# Altium schematic sheet 0135_EC_STRAP.SchDoc
size A3
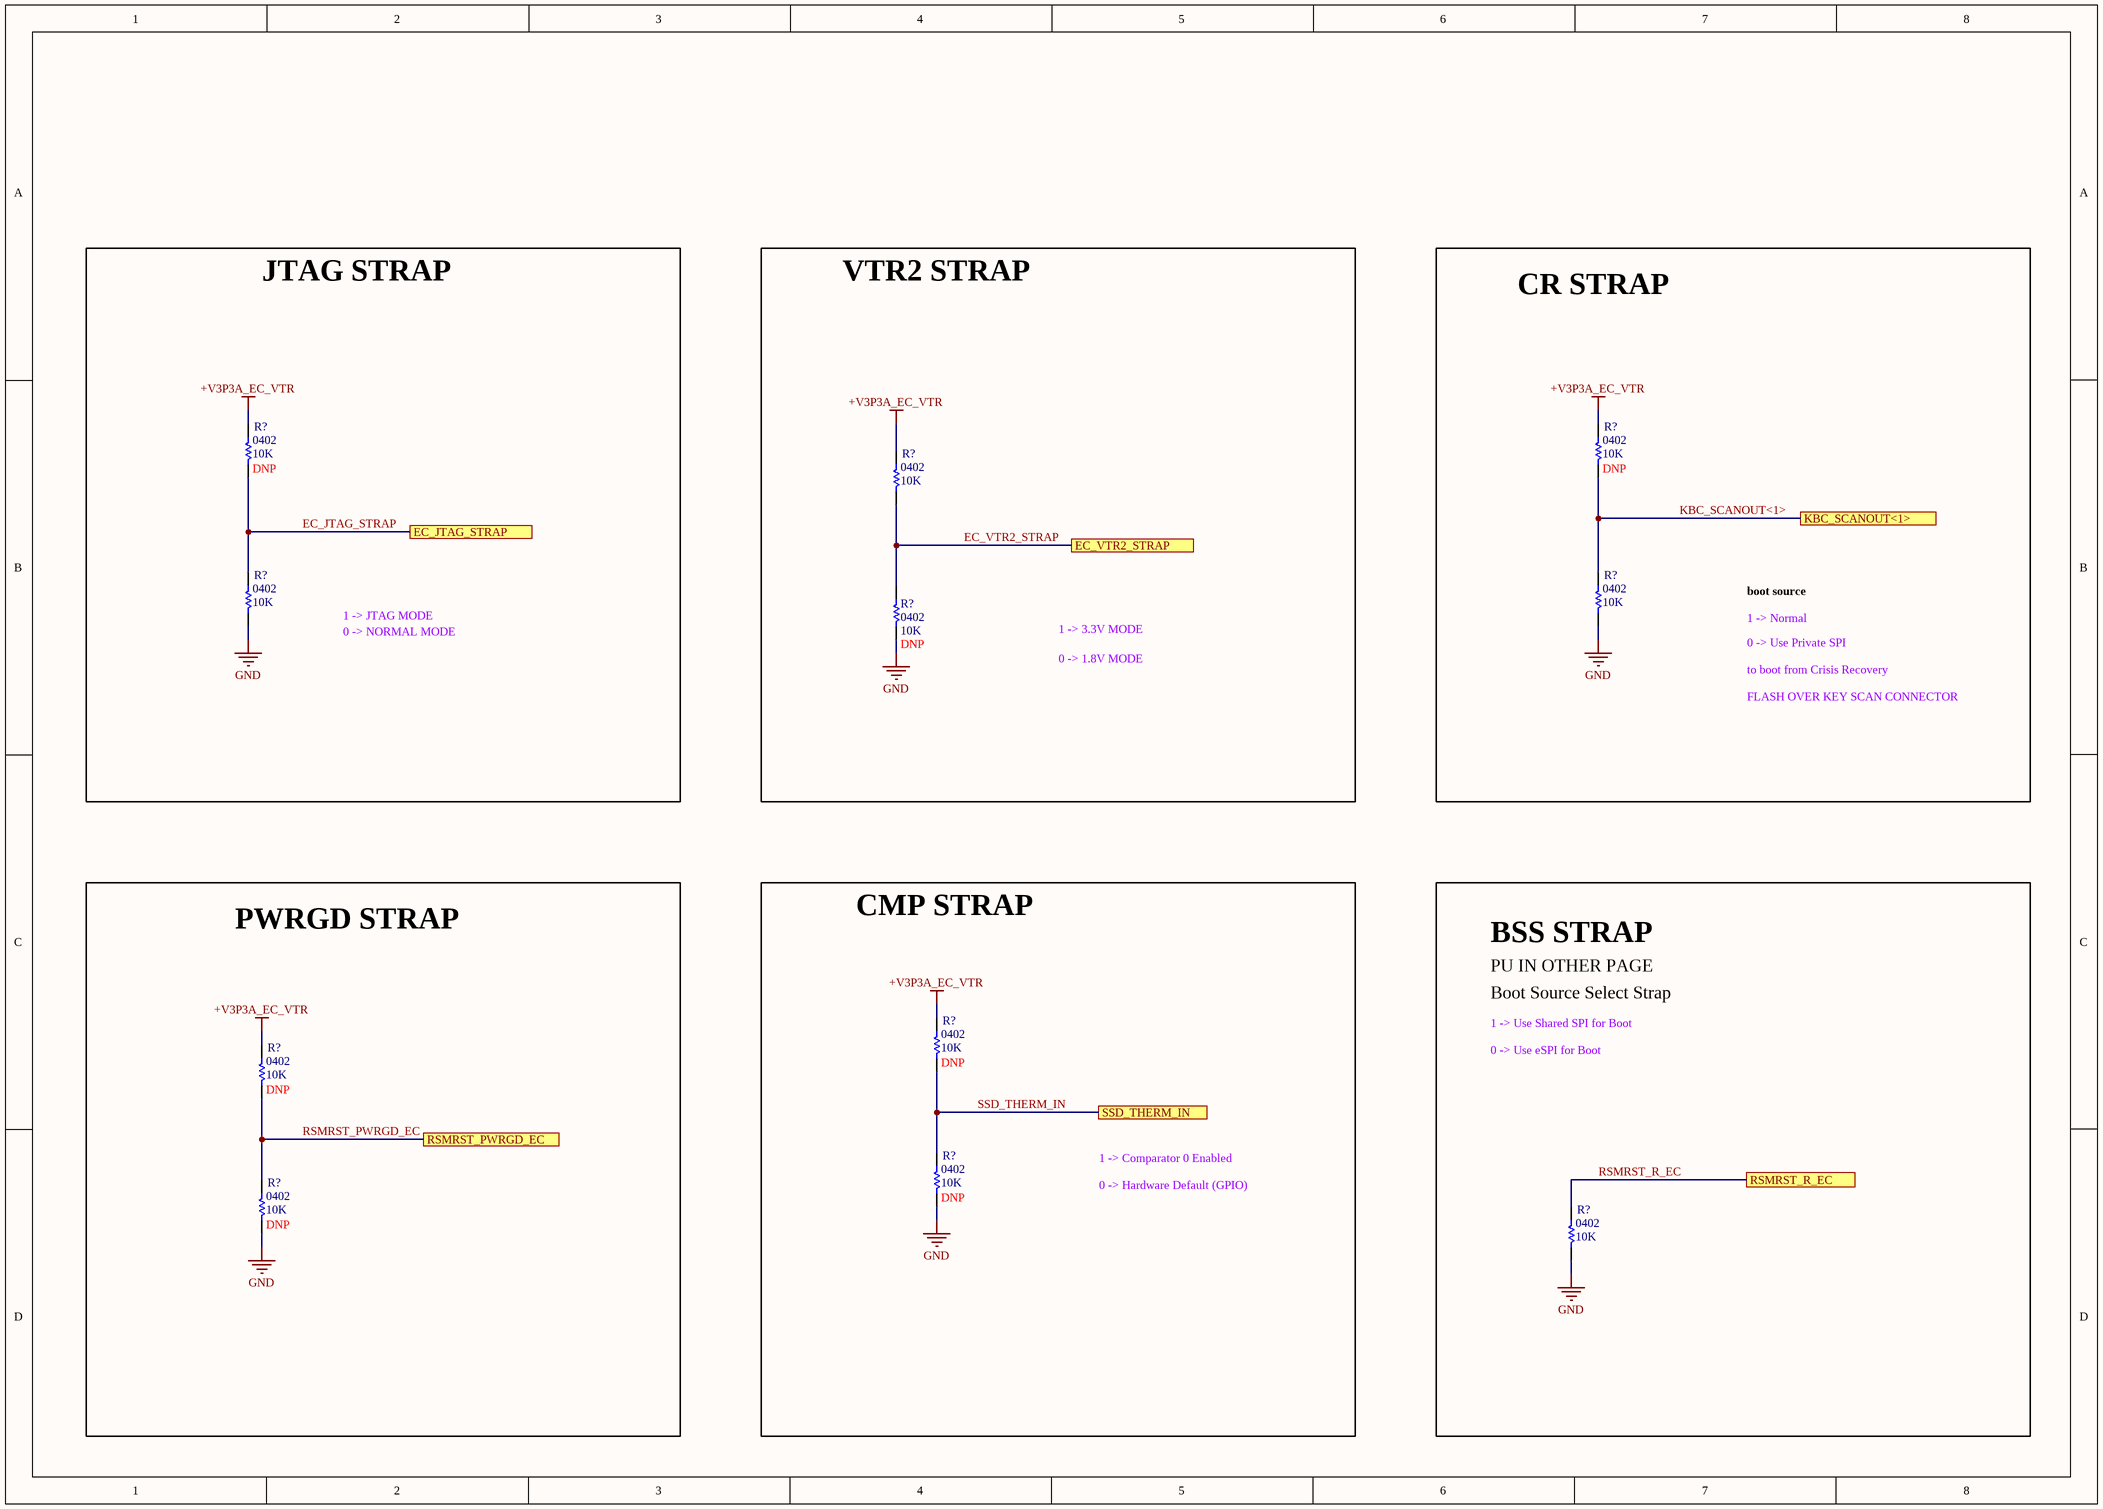
[diagram p0: 0135_EC_STRAP.SchDoc]

## Parts
(Parts that share a designator on the sheet are numbered #1, #2 ... from top to bottom, then left to right.)
R?#1  value 10K  Case/Package: 0402  [RESC0402]  (hidden comment: Res)
R?#2  value 10K  Case/Package: 0402  [RESC0402]  (hidden comment: Res)
R?#3  value 10K  Case/Package: 0402  [RESC0402]  (hidden comment: Res)
R?#4  value 10K  Case/Package: 0402  [RESC0402]  (hidden comment: Res)
R?#5  value 10K  Case/Package: 0402  [RESC0402]  (hidden comment: Res)
R?#6  value 10K  Case/Package: 0402  [RESC0402]  (hidden comment: Res)
R?#7  value 10K  Case/Package: 0402  [RESC0402]  (hidden comment: Res)
R?#8  value 10K  Case/Package: 0402  [RESC0402]  (hidden comment: Res)
R?#9  value 10K  Case/Package: 0402  [RESC0402]  (hidden comment: Res)
R?#10  value 10K  Case/Package: 0402  [RESC0402]  (hidden comment: Res)
R?#11  value 10K  Case/Package: 0402  [RESC0402]  (hidden comment: Res)

## Blocks framed on the sheet
JTAG STRAP: R?#1 R?#4
VTR2 STRAP: R?#3 R?#6
CR STRAP: R?#2 R?#5
PWRGD STRAP: R?#8 R?#10
CMP STRAP: R?#7 R?#9
BSS STRAP: R?#11

## Ports
EC_JTAG_STRAP, EC_VTR2_STRAP, KBC_SCANOUT<1>, RSMRST_PWRGD_EC, RSMRST_R_EC, SSD_THERM_IN

## Nets
+V3P3A_EC_VTR: R?#1.2 R?#2.2 R?#3.2 R?#7.2 R?#8.2
GND: R?#4.1 R?#5.1 R?#6.1 R?#9.1 R?#10.1 R?#11.1
EC_JTAG_STRAP: R?#1.1 R?#4.2 ; port EC_JTAG_STRAP
EC_VTR2_STRAP: R?#3.1 R?#6.2 ; port EC_VTR2_STRAP
KBC_SCANOUT<1>: R?#2.1 R?#5.2 ; port KBC_SCANOUT<1>
RSMRST_PWRGD_EC: R?#8.1 R?#10.2 ; port RSMRST_PWRGD_EC
RSMRST_R_EC: R?#11.2 ; port RSMRST_R_EC
SSD_THERM_IN: R?#7.1 R?#9.2 ; port SSD_THERM_IN

## Notes on the sheet
- 1 -> JTAG MODE
- 0 -> NORMAL MODE
- 1 -> 3.3V MODE
- 0 -> Use Private SPI
- boot source
- 1 -> Normal
- 0 -> 1.8V MODE
- FLASH OVER KEY SCAN CONNECTOR
- to boot from Crisis Recovery
- PU IN OTHER PAGE
- Boot Source Select Strap
- 0 -> Use eSPI for Boot
- 1 -> Use Shared SPI for Boot
- 1 -> Comparator 0 Enabled
- 0 -> Hardware Default (GPIO)

## Library data of the parts
R?#1-R?#11 = Res: Thick Film Resistor -  10Kohm, 1%, 0402
  R?#1 R?#2 R?#6-R?#10: DNP: DNP